# EAGLE design temperature-led-r1 (EAGLE 6.5.0)
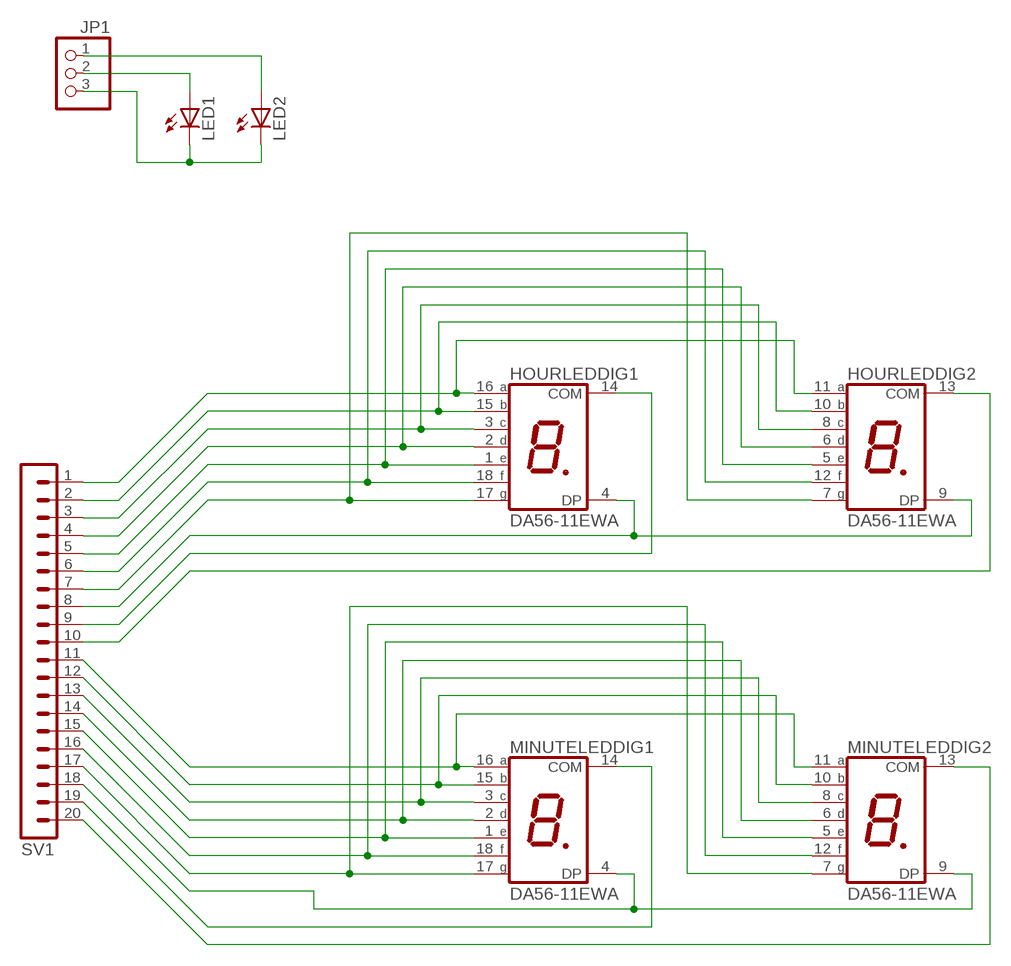
[diagram p0: schematic, sheet 1]

## Parts
HOURLED  DA56-11EWA  [DA56]
JP1  PINHD-1X3  [1X03]
LED1  LED3MM  [LED3MM]
LED2  LED3MM  [LED3MM]
MINUTELED  DA56-11EWA  [DA56]
SV1  MA20-1W  [MA20-1W]

## Nets
N$1: HOURLED.11(DIG2:A) HOURLED.16(DIG1:A) SV1.1
N$2: HOURLED.10(DIG2:B) HOURLED.15(DIG1:B) SV1.2
N$3: HOURLED.3(DIG1:C) HOURLED.8(DIG2:C) SV1.3
N$4: HOURLED.2(DIG1:D) HOURLED.6(DIG2:D) SV1.4
N$5: HOURLED.1(DIG1:E) HOURLED.5(DIG2:E) SV1.5
N$6: HOURLED.12(DIG2:F) HOURLED.18(DIG1:F) SV1.6
N$7: HOURLED.7(DIG2:G) HOURLED.17(DIG1:G) SV1.7
N$8: HOURLED.4(DIG1:DP) HOURLED.9(DIG2:DP) SV1.8
N$9: MINUTELED.11(DIG2:A) MINUTELED.16(DIG1:A) SV1.11
N$10: MINUTELED.10(DIG2:B) MINUTELED.15(DIG1:B) SV1.12
N$11: MINUTELED.3(DIG1:C) MINUTELED.8(DIG2:C) SV1.13
N$12: MINUTELED.2(DIG1:D) MINUTELED.6(DIG2:D) SV1.14
N$13: MINUTELED.1(DIG1:E) MINUTELED.5(DIG2:E) SV1.15
N$14: MINUTELED.12(DIG2:F) MINUTELED.18(DIG1:F) SV1.16
N$15: MINUTELED.7(DIG2:G) MINUTELED.17(DIG1:G) SV1.17
N$16: MINUTELED.4(DIG1:DP) MINUTELED.9(DIG2:DP) SV1.18
N$17: HOURLED.13(DIG2:COM) SV1.10
N$19: JP1.3 LED1.K(C) LED2.K(C)
N$20: HOURLED.14(DIG1:COM) SV1.9
N$21: JP1.2 LED1.A
N$22: JP1.1 LED2.A
N$26: MINUTELED.14(DIG1:COM) SV1.19
N$27: MINUTELED.13(DIG2:COM) SV1.20

## Library data of the parts
HOURLED MINUTELED = display-kingbright:DA56-11: 14.22mm (0.56INCH) DUAL DIGIT NUMERIC DISPLAYS Source: www.kingbright.com .. DA56-11SRWA.pdf; OC_FARNELL: unknown; OC_NEWARK: unknown
JP1 = pinhead:PINHD-1X3: PIN HEADER
LED1 LED2 = led:LED: LED OSRAM: - CHIPLED LG R971, LG N971, LY N971, LG Q971, LY Q971, LO R971, LY R971 LH N974, LH R974 LS Q976, LO Q976, LY Q976 LO Q996 - Hyper CHIPLED LW Q18S LB Q993, LB Q99A, LB R99A - SideLED LS A670, LO A670, LY A670, LG A670, LP A670 LB A673, LV A673, LT A673, LW A673 LH A674 LY A675 LS A676, LA A676, LO A676, LY A676, LW A676 LS A679, LY A679, LG A679 - Hyper Micro SIDELED® LS Y876, LA Y876, LO Y876, LY Y876 LT Y87S - SmartLED LW L88C, LW L88S LB L89C, LB L89S, LG L890 LS L89K, LO L89K, LY L89K LS L896, LA L896, LO L896, LY L896 - TOPLED LS T670, LO T670, LY T670, LG T670, LP T670 LSG T670, LSP T670, LSY T670, LOP T670, LYG T670 LG T671, LOG T671, LSG T671 LB T673, LV T673, LT T673, LW T673 LH T674 LS T676, LA T676, LO T676, LY T676, LB T676, LH T676, LSB T676, LW T676 LB T67C, LV T67C, LT T67C, LS T67K, LO T67K, LY T67K, LW E67C LS E67B, LA E67B, LO E67B, LY E67B, LB E67C, LV E67C, LT E67C LW T67C LS T679, LY T679, LG T679 LS T770, LO T770, LY T770, LG T770, LP T770 LB T773, LV T773, LT T773, LW T773 LH T774 LS E675, LA E675, LY E675, LS T675 LS T776, LA T776, LO T776, LY T776, LB T776 LHGB T686 LT T68C, LB T68C - Hyper Mini TOPLED® LB M676 - Mini TOPLED Santana® LG M470 LS M47K, LO M47K, LY M47K Source: http://www.osram.convergy.de LUXEON: - LUMILED® LXK2-PW12-R00, LXK2-PW12-S00, LXK2-PW14-U00, LXK2-PW14-V00 LXK2-PM12-R00, LXK2-PM12-S00, LXK2-PM14-U00 LXK2-PE12-Q00, LXK2-PE12-R00, LXK2-PE12-S00, LXK2-PE14-T00, LXK2-PE14-U00 LXK2-PB12-K00, LXK2-PB12-L00, LXK2-PB12-M00, LXK2-PB14-N00, LXK2-PB14-P00, LXK2-PB14-Q00 LXK2-PR12-L00, LXK2-PR12-M00, LXK2-PR14-Q00, LXK2-PR14-R00 LXK2-PD12-Q00, LXK2-PD12-R00, LXK2-PD12-S00 LXK2-PH12-R00, LXK2-PH12-S00 LXK2-PL12-P00, LXK2-PL12-Q00, LXK2-PL12-R00 Source: www.luxeon.com KINGBRIGHT: KA-3528ASYC Source: www.kingbright.com
SV1 = con-lstb:MA20-1W: PIN HEADER; OC_FARNELL: unknown; OC_NEWARK: unknown

## Board
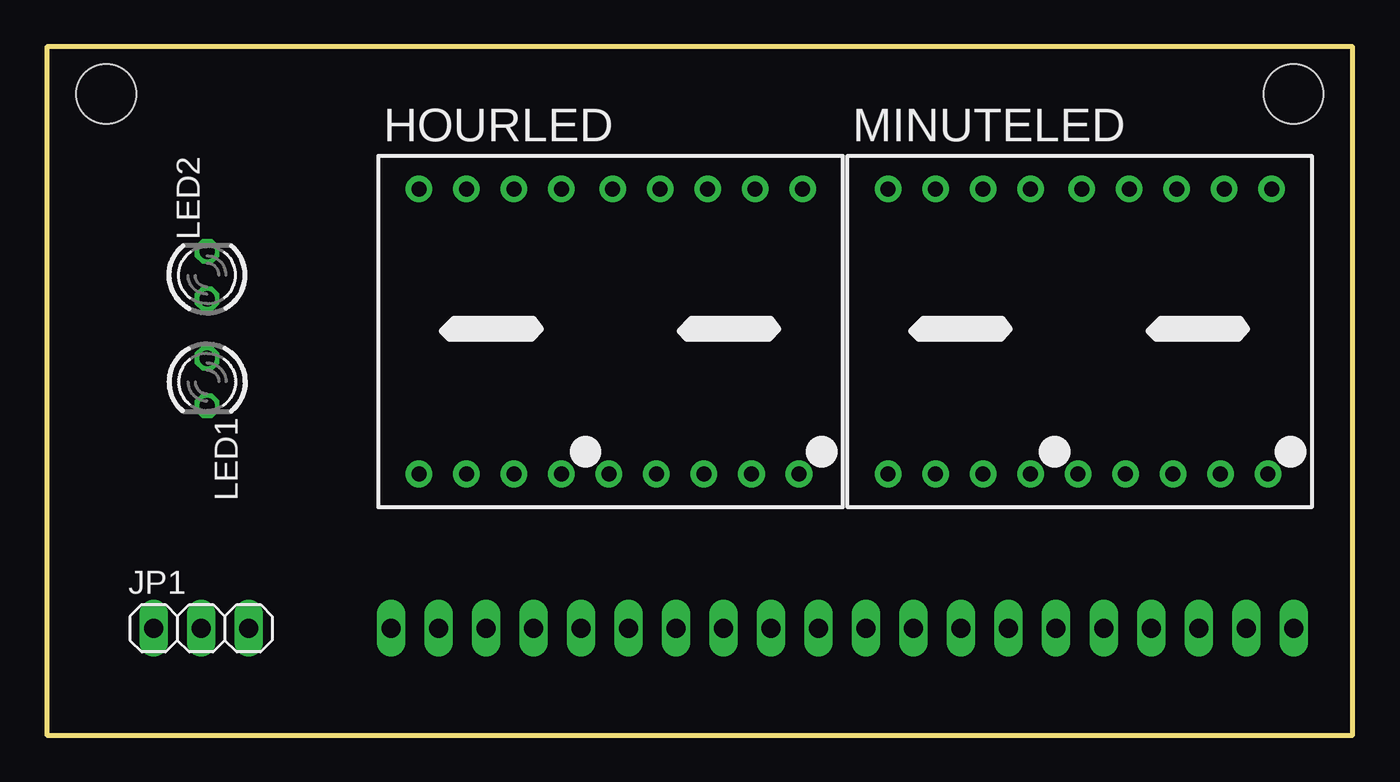
[diagram p1: board, top side]
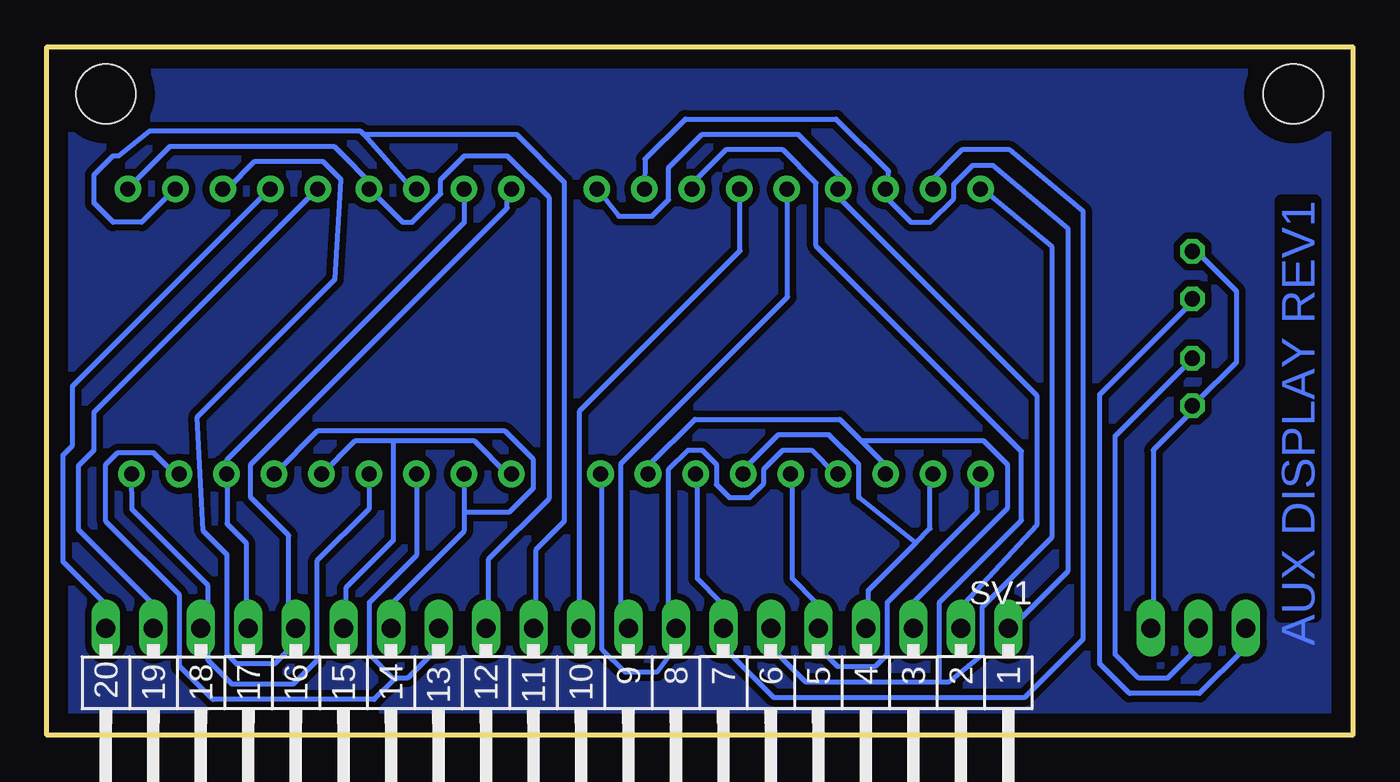
[diagram p2: board, bottom side, seen from below]

Size 69.84 x 36.82 mm. Coordinates in mm from the lower left corner, seen from the top.
Outline: 0,0 69.84,0 69.84,36.82 0,36.82 0,0
Copper layers (1*16): Top 0.035mm / dielectric 1.5mm / Bottom 0.035mm
Design rules "default *": minimum track width 10mil, minimum drill 24mil, track to track 14mil, track to pad 14mil, pad to pad 14mil, via to via 14mil, smd to smd 14mil, copper to edge 40mil, drill to drill 8mil, minimum pad ring 10mil, minimum via ring 8mil, stop-mask expansion 4mil, vias tented up to drill 0mil, thermal gap 10mil
Holes 3.2 mm at 3.18,34.29 66.67,34.29

### Footprints (pad centres in the part's own frame; a part is rotated, then mirrored left to right if it is on the bottom)
DA56 = drill 0.8 pad 1.422: 1 -10.26,-7.62; 2 -7.72,-7.62; 3 -5.18,-7.62; 4 -2.64,-7.62; 5 -0.1,-7.62; 6 2.44,-7.62; 7 4.98,-7.62; 8 7.52,-7.62; 9 10.06,-7.62; 10 10.26,7.62; 11 7.72,7.62; 12 5.18,7.62; 13 2.64,7.62; 14 0.1,7.62; 15 -2.64,7.62; 16 -5.18,7.62; 17 -7.72,7.62; 18 -10.26,7.62
1X03 = drill 1.016 long: 1 -2.54,0; 2 0,0; 3 2.54,0
LED3MM = drill 0.813 octagon: A -1.27,0; K 1.27,0
MA20-1W = drill 1.016 long: 1 -24.13,0; 2 -21.59,0; 3 -19.05,0; 4 -16.51,0; 5 -13.97,0; 6 -11.43,0; 7 -8.89,0; 8 -6.35,0; 9 -3.81,0; 10 -1.27,0; 11 1.27,0; 12 3.81,0; 13 6.35,0; 14 8.89,0; 15 11.43,0; 16 13.97,0; 17 16.51,0; 18 19.05,0; 19 21.59,0; 20 24.13,0

### Placement (x,y rotation side)
HOURLED  30.16,21.59 0 top
JP1  8.26,5.71 0 top
LED1  8.57,18.89 270 top
LED2  8.57,24.61 90 top
MINUTELED  55.25,21.59 0 top
SV1  42.55,5.71 180 bottom

### Tracks (layer width: path | path; a pad name or v marks a point on that pad's centre or on a via)
N$1
  Bottom 0.254: HOURLED.11 37.85,30.8 35.69,32.96 27.62,32.96 24.83,30.16 HOURLED.16 24.89,29.21 24.89,28.7 23.62,27.43 22.61,27.43 21.34,28.7 21.34,29.46 20.32,30.48 19.24,30.48 15.24,27.11 15.24,8.76 18.29,5.71 18.29,5.84 SV1.1
N$2
  Bottom 0.254: HOURLED.10 40.39,29.21 39.24,27.75 37.47,27.75 36.58,28.64 36.58,30.35 34.8,32.13 29.65,32.13 27.37,29.84 HOURLED.15 27.43,29.21 27.43,28.7 16.89,18.16 16.89,11.24 20.83,6.99 20.83,5.84 SV1.2
N$3
  Bottom 0.254: 26.29,15.75 27.43,16.89 35.18,16.89 37.59,14.48 37.59,13.97 HOURLED.8 | 26.29,15.75 25.15,14.61 HOURLED.3 | 26.29,15.75 19.75,15.75 18.48,14.48 18.48,12.13 23.37,7.24 23.37,5.84 SV1.3
N$4
  Bottom 0.254: 23.37,10.29 25.91,7.75 25.91,5.84 SV1.4 | 23.37,10.29 22.61,11.05 22.61,13.97 HOURLED.2 | 23.37,10.29 26.42,12.7 26.42,14.48 28,16.07 30.73,16.07 32.51,14.29 HOURLED.6
N$5
  Bottom 0.254: HOURLED.1 20.07,13.97 20.07,11.94 24.89,7.11 24.89,4.32 25.53,3.68 27.56,3.68 28.45,4.57 28.45,5.59 SV1.5 28.7,5.84 28.7,7.11 29.97,8.38 29.97,13.97 HOURLED.5
N$6
  Bottom 0.254: 22.1,2.86 29.27,2.86 30.99,4.57 30.99,5.59 SV1.6 | 22.1,2.86 21.59,2.86 19.81,4.32 19.81,6.86 16.06,10.6 16.06,26.1 19.81,29.21 HOURLED.18 | 22.1,2.86 22.1,7.11 17.72,11.49 17.72,15.18 28.7,26.16 28.7,29.53 30.48,31.3 33.53,31.3 35.31,29.53 HOURLED.12
N$7
  Bottom 0.254: HOURLED.7 35.05,13.97 35.05,8.38 33.78,7.11 33.78,5.84 SV1.7 33.53,5.59 33.53,4.57 30.99,2.03 17.53,2.03 14.41,5.14 14.41,28 18.35,31.3 20.89,31.3 22.67,29.53 HOURLED.17
N$8
  Bottom 0.254: HOURLED.4 27.69,13.97 28.96,15.24 30.48,15.24 31.5,14.22 31.5,13.46 32.26,12.7 33.34,12.7 34.04,13.4 34.04,14.48 34.8,15.24 35.56,15.24 36.58,14.22 36.58,6.1 SV1.8 36.32,5.59 36.32,4.57 37.21,3.37 38.93,3.37 40.13,4.57 40.13,13.97 HOURLED.9
N$9
  Bottom 0.254: 52.9,32.13 53.09,32.32 64.33,32.32 65.98,30.99 66.29,30.99 67.31,29.97 67.31,28.45 66.29,27.43 64.77,27.43 62.99,29.21 MINUTELED.11 | 52.9,32.13 50.29,29.21 MINUTELED.16 | 52.9,32.13 44.7,32.13 42.16,29.59 42.16,11.43 43.69,9.91 43.69,5.84 SV1.11
N$10
  Bottom 0.254: MINUTELED.10 65.53,29.21 63.25,31.5 54.48,31.5 52.2,29.21 MINUTELED.15 52.58,29.21 50.8,27.43 50.29,27.43 48.77,28.96 48.77,29.72 47.5,30.99 45.21,30.99 42.99,28.77 42.99,12.64 46.23,9.4 46.23,5.84 SV1.12
N$11
  Bottom 0.254: 51.31,3.05 51.25,2.98 52.32,1.91 60.96,1.91 62.74,3.68 62.74,7.49 66.67,11.43 66.67,14.48 66.04,15.11 64.14,15.11 62.99,13.97 MINUTELED.8 | 51.31,3.05 52.58,4.32 52.58,7.11 50.04,9.65 50.04,13.97 MINUTELED.3 | 51.31,3.05 50.55,3.05 49.02,4.57 49.02,5.59 SV1.13
N$12
  Bottom 0.254: 47.5,11.94 47.5,10.92 51.31,7.11 51.31,5.84 SV1.14 | 47.5,11.94 47.5,13.97 MINUTELED.2 | 47.5,11.94 45.09,11.94 43.82,13.21 43.82,14.73 45.34,16.26 55.37,16.26 57.66,13.97 MINUTELED.6
N$13
  Bottom 0.254: 51.31,15.75 53.34,15.75 55.12,13.97 MINUTELED.5 | 51.31,15.75 46.99,15.75 45.21,13.97 MINUTELED.1 | 51.31,15.75 51.31,10.41 53.85,7.87 53.85,5.84 SV1.15
N$14
  Bottom 0.254: MINUTELED.18 45.21,29.21 45.21,28.19 58.93,14.48 58.93,12.7 56.9,10.67 56.9,6.1 SV1.16 56.64,5.59 56.64,4.83 57.66,3.81 59.69,3.81 60.2,4.32 60.2,9.65 61.47,10.92 61.78,17.02 54.42,24.38 54.1,29.72 55.05,30.67 58.74,30.67 60.2,29.21 MINUTELED.12
N$15
  Bottom 0.254: 60.2,13.97 60.2,14.73 47.5,27.43 47.5,29.21 MINUTELED.17 | 60.2,13.97 60.2,11.3 59.18,10.29 59.18,5.84 SV1.17 | 60.2,13.97 MINUTELED.7
N$16
  Bottom 0.254: 61.21,4 61.47,4.57 61.47,5.59 SV1.18 61.21,4 | 61.21,4 59.94,2.73 56.64,2.73 55.37,4 55.37,9.34 52.58,12.13 52.58,13.97 MINUTELED.4 | 61.21,4 61.21,8 65.28,12.06 MINUTELED.9
N$17
  Bottom 0.254: SV1.10 41.34,6.1 41.34,17.34 32.77,25.91 32.77,29.21 HOURLED.13
N$19
  Bottom 0.254: LED2.K 8.38,25.91 6.22,23.75 6.22,19.94 8.38,17.78 LED1.K 8.38,17.53 10.67,15.24 10.67,5.84 JP1.3
N$20
  Bottom 0.254: SV1.9 39.12,6.1 39.12,14.54 30.23,23.43 30.23,29.21 HOURLED.14
N$21
  Bottom 0.254: LED1.A 8.64,20.07 12.7,16 12.7,4.32 11.43,3.05 9.91,3.05 8.38,4.57 8.38,5.59 JP1.2
N$22
  Bottom 0.254: LED2.A 8.64,23.11 13.53,18.22 13.53,3.81 11.94,2.22 8.19,2.22 5.84,4.57 5.84,5.59 JP1.1
N$25
  pour Bottom: -1.27,36.83 69.85,36.2 69.85,0 0,0
N$26
  Bottom 0.254: MINUTELED.14 55.37,29.21 67.31,17.27 67.31,15.24 68.14,14.41 68.14,10.99 64.26,7.11 64.26,5.84 SV1.19
N$27
  Bottom 0.254: MINUTELED.13 57.91,29.21 68.45,18.67 68.45,15.49 68.96,14.99 68.96,9.27 66.8,7.11 66.8,5.84 SV1.20

### Text on the board
Bottom: AUX DISPLAY REV1